# EAGLE design Plantenbak-v3 (EAGLE 9.6.2)
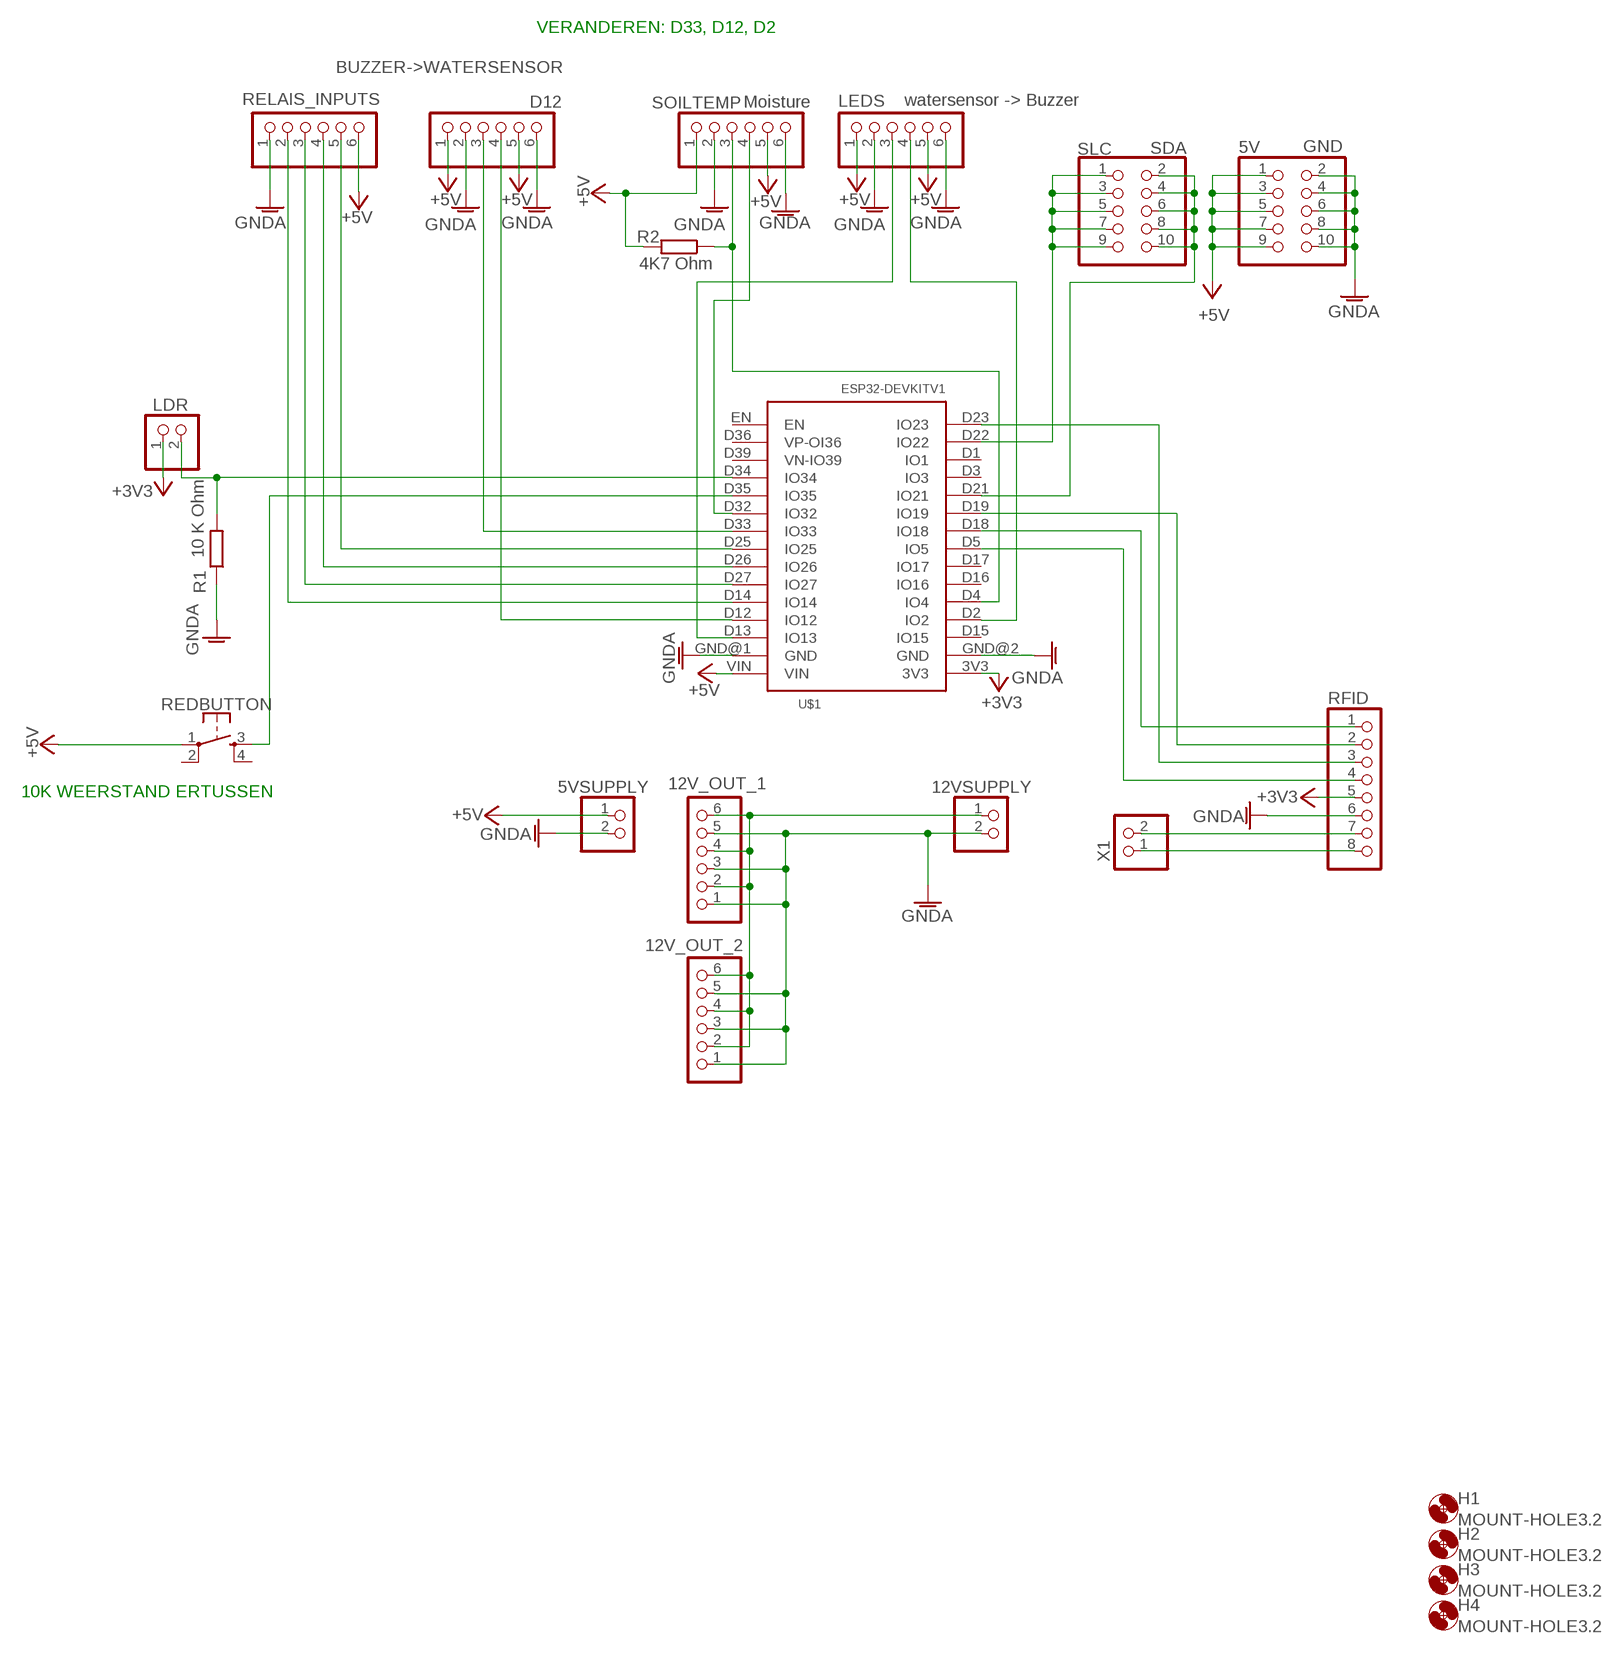
[diagram p0: schematic, sheet 1]

## Parts
5V  GND  PINHD-2X5  [2X05]
5VSUPPLY  PINHD-1X2  [1X02]
12V_OUT_1  PINHD-1X6  [1X06]
12V_OUT_2  PINHD-1X6  [1X06]
12VSUPPLY  PINHD-1X2  [1X02]
BUZZER->WATERSENSOR  D12  PINHD-1X6  [1X06]
H1  MOUNT-HOLE3.2  [3,2]
H2  MOUNT-HOLE3.2  [3,2]
H3  MOUNT-HOLE3.2  [3,2]
H4  MOUNT-HOLE3.2  [3,2]
LDR  PINHD-1X2  [1X02]
LEDS  watersensor -> Buzzer  PINHD-1X6  [1X06]
R1  10 K Ohm  R-EU_0204/7  [0204/7]
R2  4K7 Ohm  R-EU_0204/7  [0204/7]
REDBUTTON  MOMENTARY-SWITCH-SPST-2-SMD-5.2MM  [TACTILE_SWITCH_SMD_5.2MM]
RELAIS_INPUTS  PINHD-1X6  [1X06]
RFID  PINHD-1X8  [1X08]
SLC  SDA  PINHD-2X5  [2X05]
SOILTEMP  Moisture  PINHD-1X6  [1X06]
U$1  ESP32DEVKITV1  [ESP32-DEVKITV1]
X1  PINHD-1X2  [1X02]

## Nets
+3V3: LDR.1 RFID.5 U$1.3V3
+5V: 5V.1 5V.3 5V.5 5V.7 5V.9 5VSUPPLY.1 BUZZER->WATERSENSOR.1 BUZZER->WATERSENSOR.5 LEDS.1 LEDS.5 R2.2 REDBUTTON.1 RELAIS_INPUTS.6 SOILTEMP.1 SOILTEMP.5 U$1.VIN
GNDA: 5V.2 5V.4 5V.6 5V.8 5V.10 5VSUPPLY.2 12V_OUT_1.1 12V_OUT_1.3 12V_OUT_1.5 12V_OUT_2.1 12V_OUT_2.3 12V_OUT_2.5 12VSUPPLY.2 BUZZER->WATERSENSOR.2 BUZZER->WATERSENSOR.6 LEDS.2 LEDS.6 R1.1 RELAIS_INPUTS.1 RFID.6 SOILTEMP.2 SOILTEMP.6 U$1.GND@1(GND) U$1.GND@2(GND)
N$1: SLC.1 SLC.3 SLC.5 SLC.7 SLC.9 U$1.D22(IO22)
N$2: LEDS.3 U$1.D13(IO13)
N$3: SLC.2 SLC.4 SLC.6 SLC.8 SLC.10 U$1.D21(IO21)
N$4: SOILTEMP.4 U$1.D32(IO32)
N$5: LDR.2 R1.2 U$1.D34(IO34)
N$6: RFID.2 U$1.D19(IO19)
N$7: RFID.3 U$1.D23(IO23)
N$8: RFID.1 U$1.D18(IO18)
N$9: RFID.4 U$1.D5(IO5)
N$10: LEDS.4 U$1.D2(IO2)
N$11: R2.1 SOILTEMP.3 U$1.D4(IO4)
N$12: RFID.7 X1.2
N$13: RFID.8 X1.1
N$14: RELAIS_INPUTS.2 U$1.D14(IO14)
N$15: RELAIS_INPUTS.3 U$1.D27(IO27)
N$16: BUZZER->WATERSENSOR.3 U$1.D33(IO33)
N$17: BUZZER->WATERSENSOR.4 U$1.D12(IO12)
N$18: REDBUTTON.3 U$1.D35(IO35)
N$19: RELAIS_INPUTS.4 U$1.D26(IO26)
N$20: RELAIS_INPUTS.5 U$1.D25(IO25)
N$25: 12V_OUT_1.2 12V_OUT_1.4 12V_OUT_1.6 12V_OUT_2.2 12V_OUT_2.4 12V_OUT_2.6 12VSUPPLY.1
Unconnected: REDBUTTON.2 REDBUTTON.4 U$1.D1(IO1) U$1.D3(IO3) U$1.D15(IO15) U$1.D16(IO16) U$1.D17(IO17) U$1.D36(VP-OI36) U$1.D39(VN-IO39) U$1.EN

## Notes on the sheet
- VERANDEREN: D33, D12, D2
- 10K WEERSTAND ERTUSSEN

## Library data of the parts
5V SLC = pinhead:PINHD-2X5: PIN HEADER
5VSUPPLY 12VSUPPLY LDR X1 = pinhead:PINHD-1X2: PIN HEADER
12V_OUT_1 12V_OUT_2 BUZZER->WATERSENSOR LEDS RELAIS_INPUTS SOILTEMP = pinhead:PINHD-1X6: PIN HEADER
H1-H4 = holes:MOUNT-HOLE: MOUNTING HOLE with drill center marker
R1 R2 = rcl:R-EU_: RESISTOR, European symbol; SPICEPREFIX: R
REDBUTTON = SparkFun-Switches:MOMENTARY-SWITCH-SPST-2: Momentary Switch (Pushbutton) - SPST - Two Circuits Normally-open (NO) SPST momentary switches (buttons, pushbuttons). Schematic symbol includes two switch circuits. Variants SMD-4.6MMX2.8MM - 4.60mm x 2.80mm Tactile Momentary Button Switch - Used on SparkFun Pro Micro - RP2040 <https://www.sparkfun.com/products/17717> SMD-5.2MM - Mini Pushbutton Switch - SMD <https://www.sparkfun.com/products/8720> - Used on Arduino Pro Mini <https://www.sparkfun.com/products/11114>; PROD_ID: SWCH-08247; SF_SKU: COM-08720
RFID = pinhead:PINHD-1X8: PIN HEADER
U$1 = ESP32-DEVKITV1:ESP32DEVKITV1

## Board
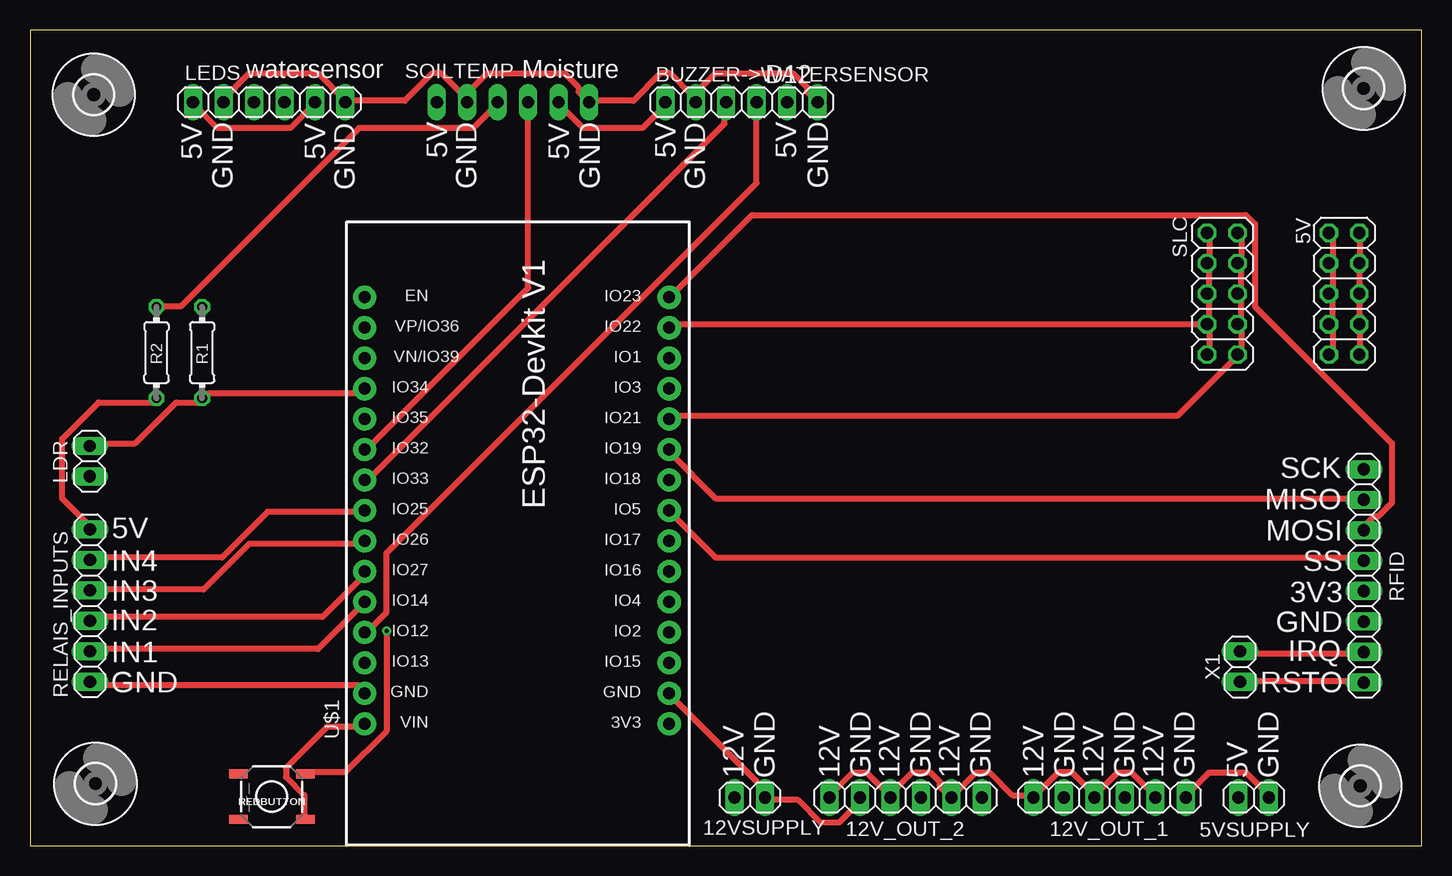
[diagram p1: board, top side]
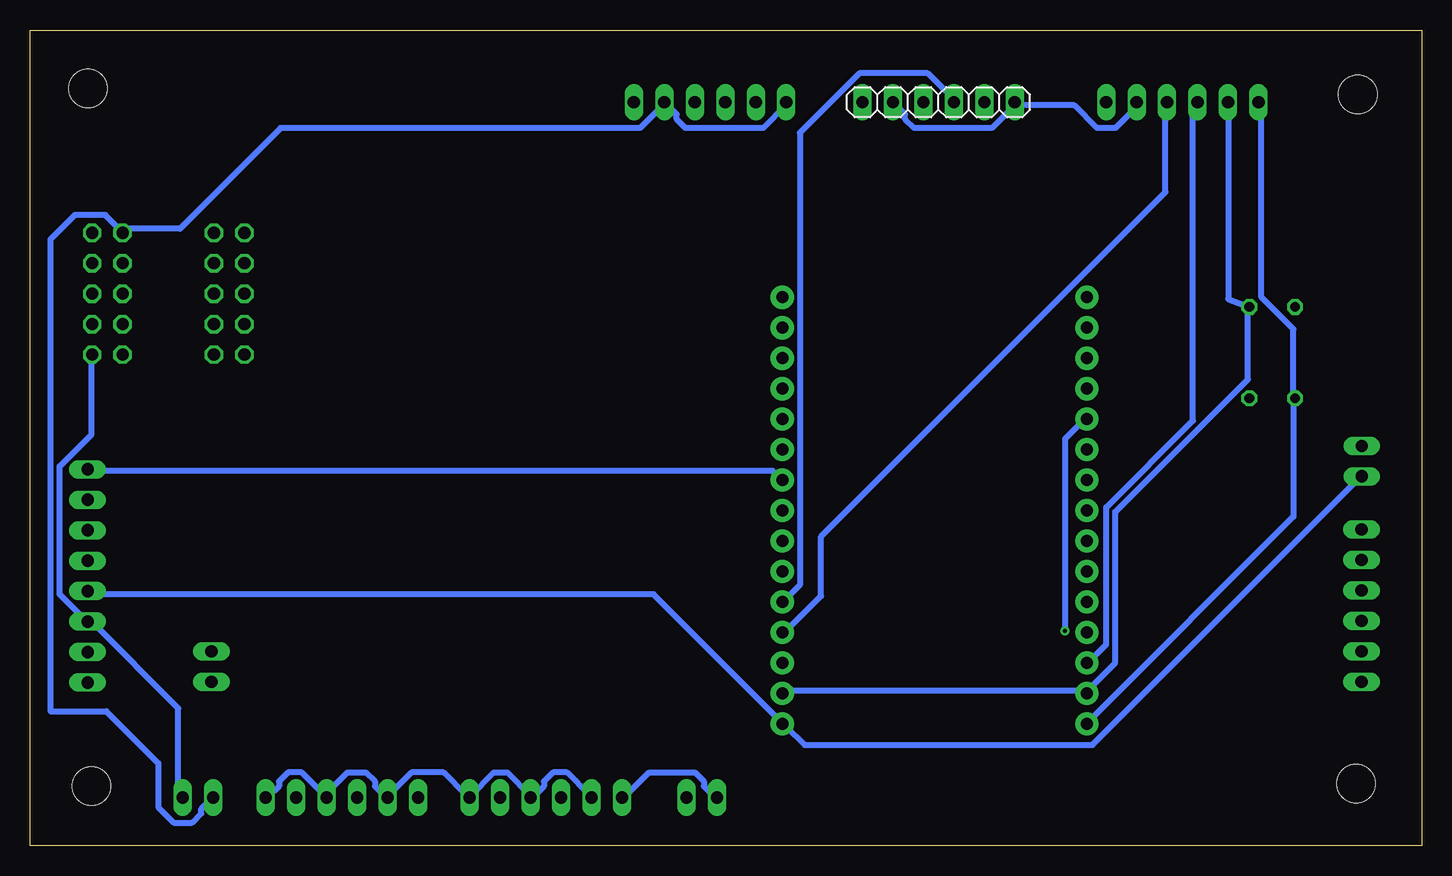
[diagram p2: board, bottom side, seen from below]

Size 116 x 68 mm. Coordinates in mm from the lower left corner, seen from the top.
Outline: 0,0 116,0 116,68 0,68 0,0
Copper layers (1*16): Top 0.035mm / dielectric 1.5mm / Bottom 0.035mm
Design rules "default *": minimum track width 20mil, minimum drill 0.35mm, track to track 10mil, track to pad 10mil, pad to pad 10mil, via to via 10mil, smd to smd 10mil, copper to edge 40mil, drill to drill 6mil, minimum pad ring 10mil, minimum via ring 8mil, stop-mask expansion 4mil, vias tented up to drill 0mil, thermal gap 10mil

### Footprints (pad centres in the part's own frame; a part is rotated, then mirrored left to right if it is on the bottom)
2X05 = drill 1.016 octagon: 1 -5.08,-1.27; 2 -5.08,1.27; 3 -2.54,-1.27; 4 -2.54,1.27; 5 0,-1.27; 6 0,1.27; 7 2.54,-1.27; 8 2.54,1.27; 9 5.08,-1.27; 10 5.08,1.27
1X02 = drill 1.016 long: 1 -1.27,0; 2 1.27,0
1X06 = drill 1.016 long: 1 -6.35,0; 2 -3.81,0; 3 -1.27,0; 4 1.27,0; 5 3.81,0; 6 6.35,0
3,2 = hole 3.2: 0,0
0204/7 = drill 0.813 octagon: 1 -3.81,0; 2 3.81,0
TACTILE_SWITCH_SMD_5.2MM = smd 1.524 x 0.762: 1 -2.794,1.905; 2 2.794,1.905; 3 -2.794,-1.905; 4 2.794,-1.905
1X08 = drill 1.016 long: 1 -8.89,0; 2 -6.35,0; 3 -3.81,0; 4 -1.27,0; 5 1.27,0; 6 3.81,0; 7 6.35,0; 8 8.89,0
ESP32-DEVKITV1 = drill 1 pad 1.93: 3V3 -16.52,-12.27; D1 13.96,-12.27; D2 -8.9,-12.27; D3 11.42,-12.27; D4 -6.36,-12.27; D5 1.26,-12.27; D12 -8.9,13.135; D13 -11.44,13.135; D14 -6.36,13.135; D15 -11.44,-12.27; D16 -3.82,-12.27; D17 -1.28,-12.27; D18 3.8,-12.27; D19 6.34,-12.27; D21 8.88,-12.27; D22 16.5,-12.27; D23 19.04,-12.27; D25 1.26,13.135; D26 -1.28,13.135; D27 -3.82,13.135; D32 6.34,13.135; D33 3.8,13.135; D34 11.42,13.135; D35 8.88,13.135; D36 16.5,13.135; D39 13.96,13.135; EN 19.04,13.135; GND@1 -13.98,13.135; GND@2 -13.98,-12.27; VIN -16.52,13.135

### Placement (x,y rotation side)
5V  109.55,46.01 270 top
5VSUPPLY  102,4 0 top
12V_OUT_1  90,4 180 top
12V_OUT_2  73,4 180 top
12VSUPPLY  60,4 0 top
BUZZER->WATERSENSOR  59.31,61.98 0 top
H1  5.31,62.62 0 top
H2  5.46,5.16 0 top
H3  111.17,63.12 0 top
H4  110.89,4.97 0 top
LDR  4.97,32.05 90 top
LEDS  19.94,61.98 0 top
R1  14.35,41.1 270 top
R2  10.54,41.1 270 top
REDBUTTON  20.16,4.08 180 top
RELAIS_INPUTS  5,20 90 top
RFID  111.2,22.48 270 top
SLC  99.39,46.01 270 top
SOILTEMP  40.26,61.98 180 bottom
U$1  41.02,26.67 90 top
X1  100.87,14.9 90 top

### Tracks (layer width: path | path; a pad name or v marks a point on that pad's centre or on a via)
+3V3
  Bottom 0.508: RFID.5 110.87,20.95 64.01,20.95 53.34,10.29 U$1.3V3 52.96,9.91 51.44,8.38 27.43,8.38 5.33,30.48 LDR.1
+5V
  Top 0.508: 5V.9 108.58,41.15 108.58,43.43 5V.7 108.58,43.81 108.58,45.72 5V.5 108.58,46.1 108.58,48.39 5V.3 108.58,48.77 108.58,51.05 5V.1 | SOILTEMP.5 44.2,61.72 46.1,59.82 51.05,59.82 52.96,61.72 BUZZER->WATERSENSOR.1 | LEDS.1 13.72,61.72 15.62,59.82 21.72,59.82 23.62,61.72 LEDS.5 | REDBUTTON.1 22.86,2.29 22.86,4.19 21.34,5.71 21.34,6.48 24.77,9.91 27.81,9.91 U$1.VIN | R2.2 10.29,36.96 5.71,36.96 2.67,33.91 2.67,28.96 4.95,26.67 RELAIS_INPUTS.6
  Bottom 0.508: 5VSUPPLY.1 100.97,3.81 101.73,3.05 101.73,2.67 102.49,1.91 104.01,1.91 105.3,3.19 105.3,6.86 109.63,11.19 114.3,11.19 114.3,50.53 112.25,52.58 109.73,52.58 108.58,51.44 5V.1 108.2,51.44 103.49,51.44 95.11,59.82 65.15,59.82 63.25,61.72 BUZZER->WATERSENSOR.5 62.87,61.72 62.1,60.96 62.1,60.58 61.34,59.82 54.86,59.82 52.96,61.72 BUZZER->WATERSENSOR.1 | 33.91,61.72 28.96,61.72 27.05,59.82 25.53,59.82 23.62,61.72 LEDS.5 | 33.91,61.72 35.81,59.82 42.29,59.82 43.05,60.58 43.05,60.96 43.81,61.72 SOILTEMP.5 | 33.91,61.72 SOILTEMP.1 | U$1.VIN 27.81,10.29 10.67,27.43 10.67,36.96 R2.2 10.67,37.34 10.67,43.05 13.34,45.72 13.34,61.72 LEDS.1
GNDA
  Top 0.508: 5V.2 110.87,51.05 110.87,48.77 5V.4 110.87,48.39 110.87,46.1 5V.6 110.87,45.72 110.87,43.81 5V.8 110.87,43.43 110.87,41.15 5V.10 | 5VSUPPLY.2 103.25,4.19 101.35,6.1 98.3,6.1 96.39,4.19 12V_OUT_1.1 | 55.24,62.48 55.63,62.1 BUZZER->WATERSENSOR.2 55.24,62.48 | 55.24,62.48 53.34,64.39 52.58,64.39 50.29,62.1 46.86,62.1 SOILTEMP.6 46.48,62.1 45.72,62.87 45.72,63.25 44.58,64.39 38.1,64.39 36.2,62.48 | 55.24,62.48 57.15,64.39 63.63,64.39 64.77,63.25 64.77,62.87 65.53,62.1 BUZZER->WATERSENSOR.6 | 36.2,62.48 36.58,62.1 SOILTEMP.2 36.2,62.48 | 36.2,62.48 34.29,64.39 33.53,64.39 31.24,62.1 26.67,62.1 LEDS.6 26.29,62.1 24,64.39 18.29,64.39 16,62.1 LEDS.2 | RELAIS_INPUTS.1 5.33,13.34 27.43,13.34 27.81,12.95 U$1.GND@1 | 12V_OUT_2.5 69.34,3.81 67.44,1.91 65.91,1.91 64.01,3.81 61.34,3.81 12VSUPPLY.2 60.96,4.19 60.96,4.95 53.34,12.57 U$1.GND@2
  Bottom 0.508: 91.44,4.19 89.53,6.1 88.01,6.1 87.25,5.33 87.25,4.95 86.49,4.19 12V_OUT_1.5 86.11,4.19 84.2,6.1 81.53,6.1 79.63,4.19 12V_OUT_2.1 79.25,4.19 77.34,6.1 76.2,6.1 74.3,4.19 12V_OUT_2.3 73.91,4.19 73.15,4.95 73.15,5.33 72.39,6.1 71.25,6.1 69.34,4.19 12V_OUT_2.5 | 91.44,4.19 93.34,6.1 94.49,6.1 95.25,5.33 95.25,4.95 96.01,4.19 12V_OUT_1.1 | 91.44,4.19 12V_OUT_1.3 | 5VSUPPLY.2 103.63,4.19 103.63,11.43 110.87,18.67 RFID.6 111.25,18.67 113.54,20.95 113.54,31.62 110.87,34.29 110.87,40.77 5V.10 | LEDS.2 16.11,61.95 16.11,45.57 R1.1 14.48,44.58 14.48,38.86 25.53,27.81 25.53,15.24 27.81,12.95 U$1.GND@1 28.19,12.95 52.96,12.95 U$1.GND@2
N$1
  Top 0.508: SLC.1 98.3,51.05 98.3,48.77 SLC.3 98.3,48.39 98.3,46.1 SLC.5 98.3,45.72 98.3,43.81 SLC.7 | SLC.9 98.3,41.15 98.3,43.43 SLC.7 | U$1.D22 53.34,43.43 97.92,43.43 SLC.7
N$2
  Bottom 0.508: LEDS.3 19.05,61.72 19.05,35.43 26.29,28.19 26.29,16.76 27.81,15.24 U$1.D13
N$3
  Top 0.508: SLC.2 100.97,51.05 100.97,48.77 SLC.4 100.97,48.39 100.97,46.1 SLC.6 100.97,45.72 100.97,43.81 SLC.8 100.97,43.43 100.97,41.15 SLC.10 100.58,40.77 95.63,35.81 53.34,35.81 U$1.D21
N$4
  Top 0.508: SOILTEMP.4 41.53,61.72 41.53,46.48 28.19,33.15 U$1.D32
N$5
  Top 0.508: LDR.2 5.33,33.53 8.76,33.53 12.19,36.96 14.1,36.96 R1.2 14.48,37.34 14.86,37.72 27.81,37.72 U$1.D34
N$6
  Top 0.508: RFID.2 110.87,28.96 57.15,28.96 53.34,32.77 U$1.D19
N$7
  Top 0.508: RFID.3 111.25,26.67 112.01,27.43 112.39,27.43 113.54,28.57 113.54,33.53 102.11,44.96 102.11,51.82 101.35,52.58 60.2,52.58 53.34,45.72 U$1.D23
N$8
  Bottom 0.508: RFID.1 110.87,31.24 54.1,31.24 53.34,30.48 U$1.D18
N$9
  Top 0.508: RFID.4 110.87,24 57.15,24 53.34,27.81 U$1.D5
N$10
  Bottom 0.508: LEDS.4 21.34,61.72 21.34,54.48 50.05,25.77 50.05,20.81 52.96,17.91 U$1.D2
N$11
  Top 0.508: R2.1 10.67,44.96 12.57,44.96 27.43,59.82 36.96,59.82 38.86,61.72 SOILTEMP.3
  Bottom 0.508: U$1.D4 52.96,20.57 51.82,21.72 51.82,59.44 46.86,64.39 41.15,64.39 38.86,62.1 SOILTEMP.3
N$12
  Top 0.508: RFID.7 110.87,16 100.97,16 X1.2
N$13
  Top 0.508: RFID.8 110.87,13.72 100.97,13.72 X1.1
N$14
  Top 0.508: RELAIS_INPUTS.2 5.33,16.38 24,16.38 27.81,20.19 U$1.D14
N$15
  Top 0.508: RELAIS_INPUTS.3 5.33,19.05 24.38,19.05 27.81,22.48 U$1.D27
N$16
  Top 0.508: BUZZER->WATERSENSOR.3 57.91,61.72 57.91,60.2 28.19,30.48 U$1.D33
N$17
  Top 0.508: BUZZER->WATERSENSOR.4 60.58,61.72 60.58,55.24 29.72,24.38 29.72,19.43 28.19,17.91 U$1.D12
N$18  (via drill 0.35)
  Top 0.508: v29.72,17.91 29.72,9.53 26.29,6.1 23.24,6.1 REDBUTTON.3
  Bottom 0.508: v29.72,17.91 29.72,33.91 28.19,35.43 U$1.D35
N$19
  Top 0.508: RELAIS_INPUTS.4 5.33,21.34 14.48,21.34 18.29,25.15 27.81,25.15 U$1.D26
N$20
  Top 0.508: RELAIS_INPUTS.5 5.33,24 16,24 19.81,27.81 27.81,27.81 U$1.D25
N$25
  Top 0.508: 88.77,4.19 86.87,6.1 85.72,6.1 83.82,4.19 12V_OUT_1.6 83.44,4.19 81.92,4.19 80.01,6.1 78.87,6.1 76.96,4.19 12V_OUT_2.2 76.58,4.19 75.82,4.95 75.82,5.33 75.06,6.1 73.53,6.1 71.63,4.19 | 88.77,4.19 90.68,6.1 91.82,6.1 93.73,4.19 12V_OUT_1.2 | 88.77,4.19 12V_OUT_1.4 | 71.63,4.19 69.72,6.1 68.58,6.1 66.67,4.19 12V_OUT_2.6 | 71.63,4.19 12V_OUT_2.4
  Bottom 0.508: 12VSUPPLY.1 59.05,4.19 59.82,4.95 59.82,5.33 60.58,6.1 64.39,6.1 66.29,4.19 12V_OUT_2.6

### Text on the board
tPlace: watersensor | Moisture | D12 | 5V | GND | 5V | GND | 5V | GND | 5V | GND | 5V | GND | 5V | GND | SCK | MISO | 5V | MOSI | IN4 | SS | IN3 | 3V3 | IN2 | GND | IN1 | IRQ | GND | RSTO | 12V | GND | 12V | GND | 12V | GND | 12V | GND | 12V | GND | 12V | GND | 12V | GND | 5V | GND